# EasyEDA schematic SCH_脑机检测_2021-08-07.json
TITLE: 脑电信号采集主控板; REV: 1.0; Date: 2021-07-29; Sheet: 1/1; Drawn By: SupberMan; Company: Your Company
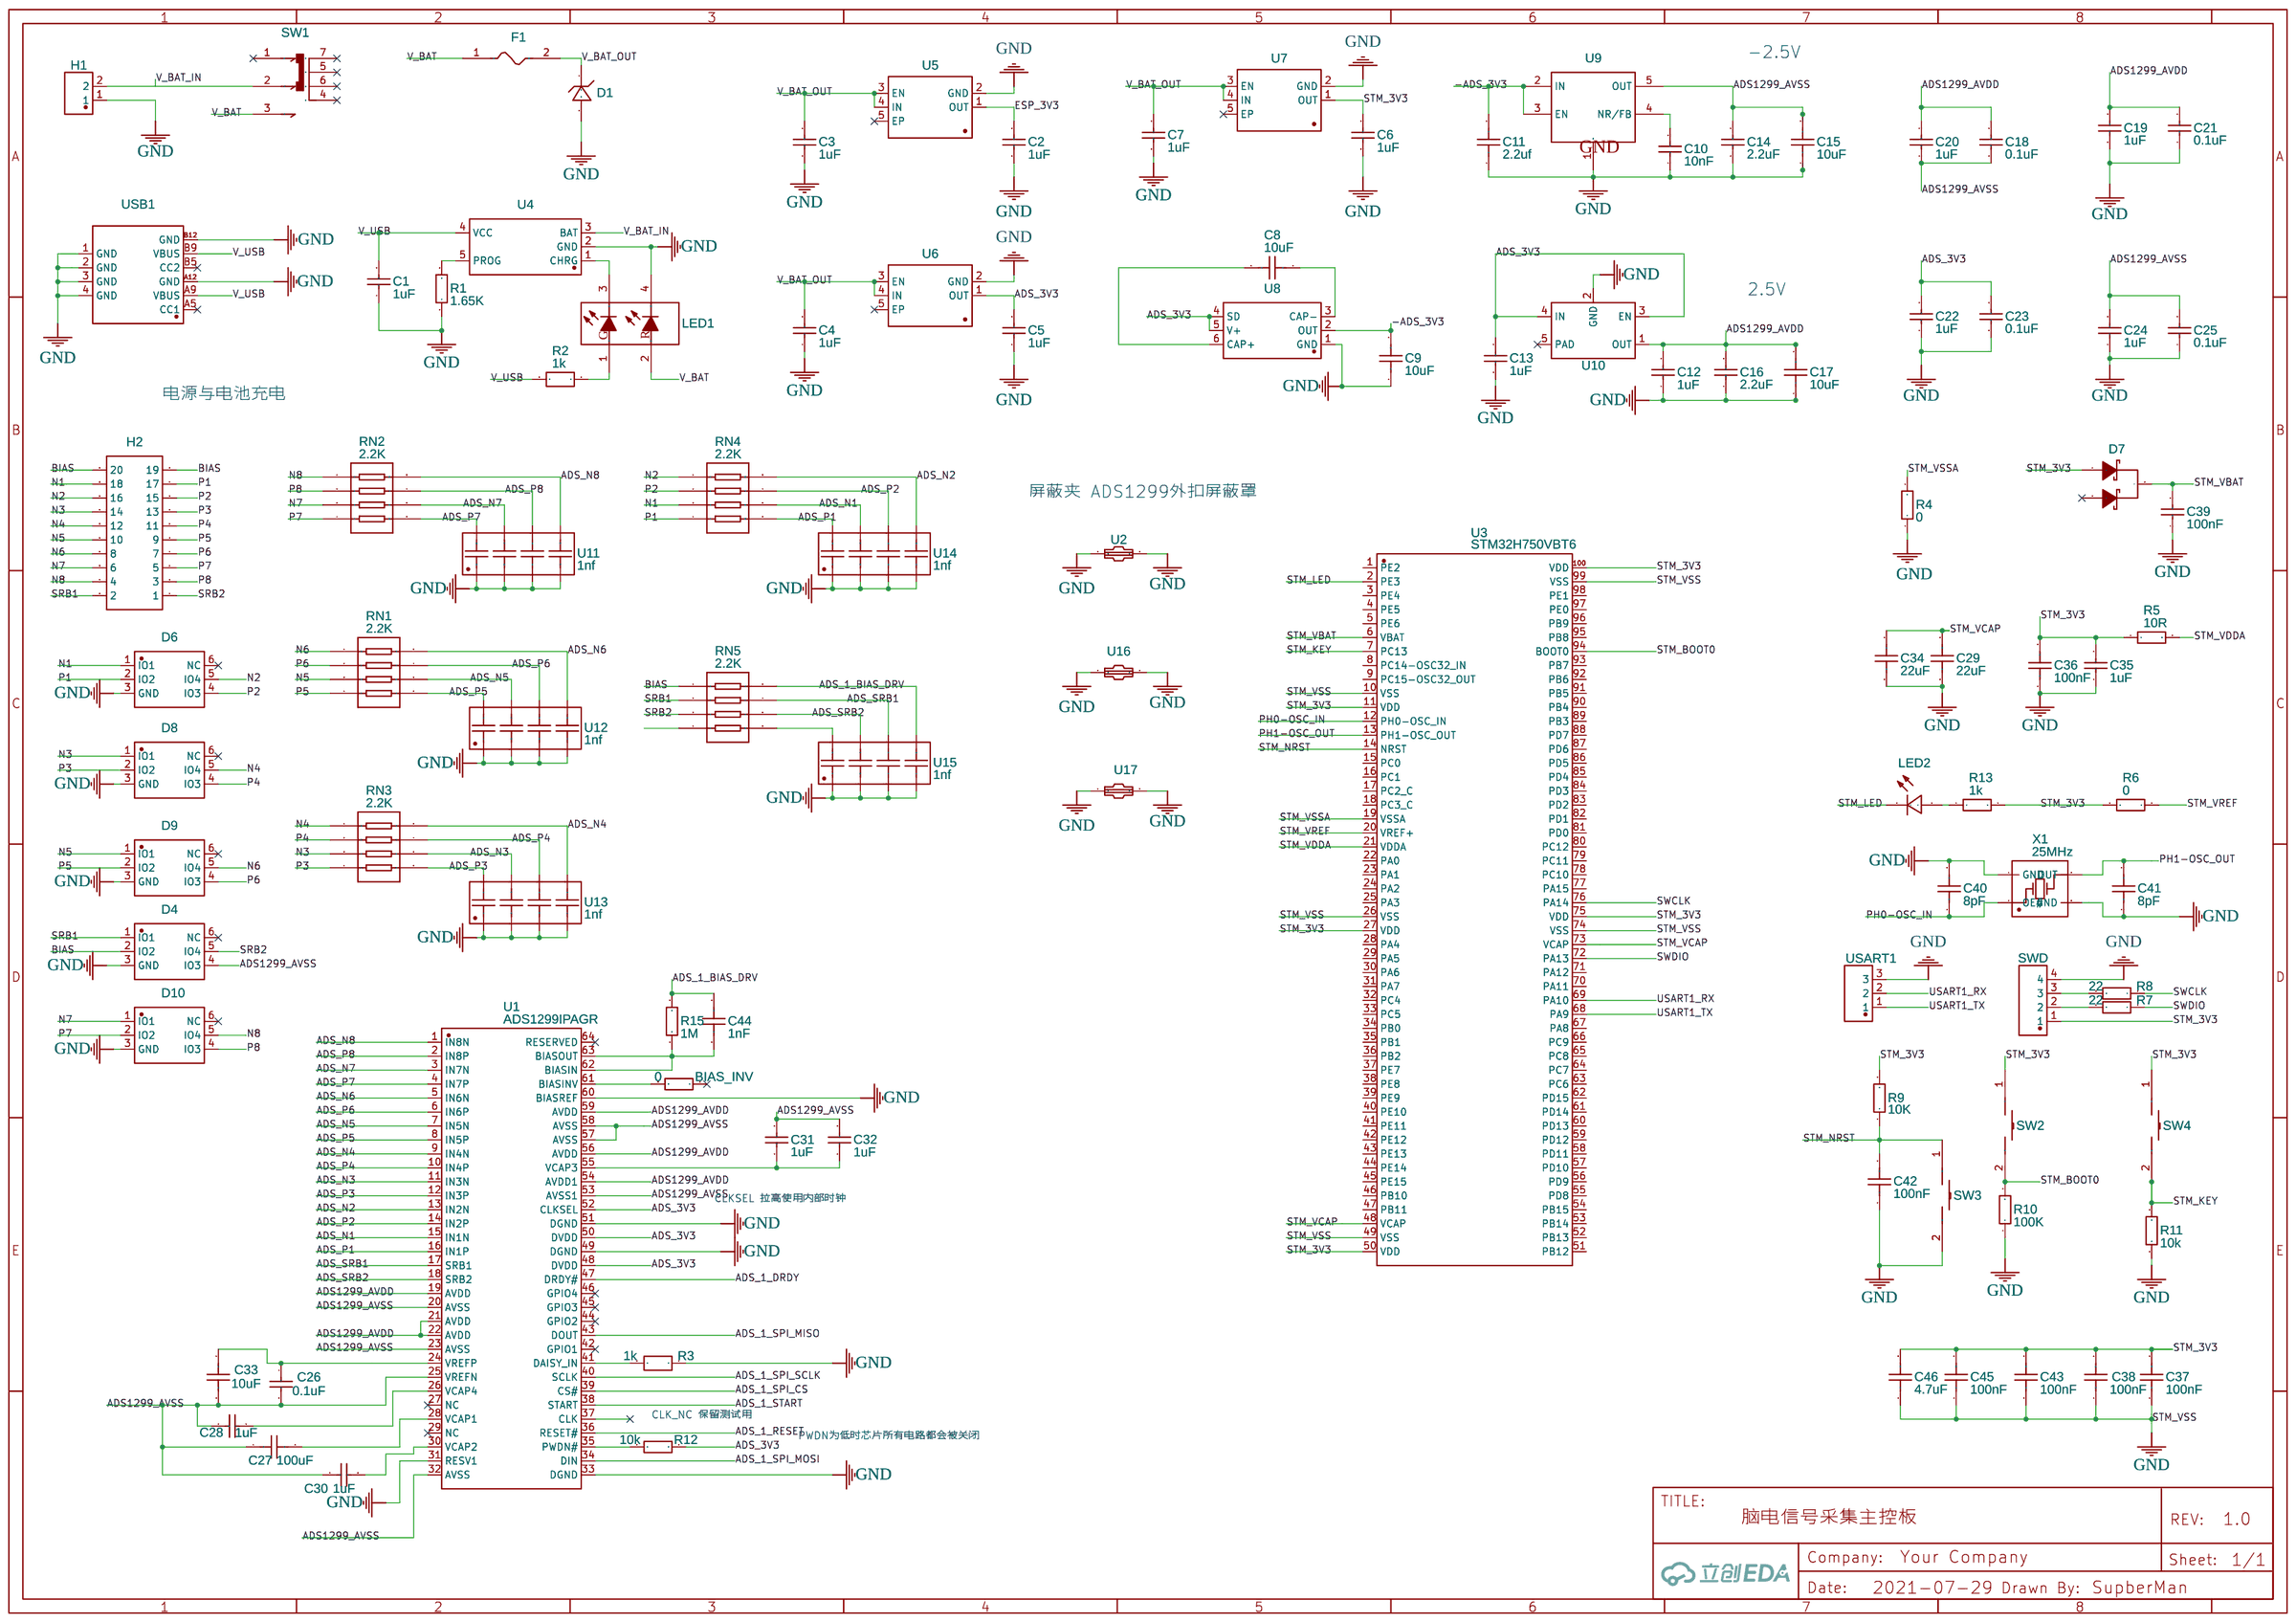
[diagram p0: schematic sheet]

## Parts
BIAS_INV  0  [R0402]
C1  1uF  [C0603]
C2  1uF  [C0402]
C3  1uF  [C0603]
C4  1uF  [C0603]
C5  1uF  [C0402]
C6  1uF  [C0402]
C7  1uF  [C0603]
C8  10uF  [C0603]
C9  10uF  [C0603]
C10  10nF  [C0402]
C11  2.2uf  [C0402]
C12  1uF  [C0402]
C13  1uF  [C0402]
C14  2.2uF  [C0402]
C15  10uF  [C0603]
C16  2.2uF  [C0402]
C17  10uF  [C0603]
C18  0.1uF  [C0402]
C19  1uF  [C0402]
C20  1uF  [C0402]
C21  0.1uF  [C0402]
C22  1uF  [C0402]
C23  0.1uF  [C0402]
C24  1uF  [C0402]
C25  0.1uF  [C0402]
C26  0.1uF  [C0402]
C27  100uF  [C1210]
C28  1uF  [C0402]
C29  22uF  [C0402]
C30  1uF  [C0402]
C31  1uF  [C0402]
C32  1uF  [C0402]
C33  10uF  [C0603]
C34  22uF  [C0402]
C35  1uF  [C0402]
C36  100nF  [C0402]
C37  100nF  [C0402]
C38  100nF  [C0402]
C39  100nF  [C0402_NEW]
C40  8pF  [C0402]
C41  8pF  [C0402]
C42  100nF  [C0402]
C43  100nF  [C0402]
C44  1nF  [C0402]
C45  100nF  [C0402]
C46  4.7uF  [C0402]
D1  PTVS6V5S1UR  [SOD-123_L2.8-W1.8-LS3.7-RD]
D4  TPD4E1B06DCKR  [SC-70-6_L2.2-W1.3-P0.65-LS2.1-BL]
D6  TPD4E1B06DCKR  [SC-70-6_L2.2-W1.3-P0.65-LS2.1-BL]
D7  BAT54C_C556168  [SOT-23-3_L2.9-W1.3-P1.90-LS2.4-BR]
D8  TPD4E1B06DCKR  [SC-70-6_L2.2-W1.3-P0.65-LS2.1-BL]
D9  TPD4E1B06DCKR  [SC-70-6_L2.2-W1.3-P0.65-LS2.1-BL]
D10  TPD4E1B06DCKR  [SC-70-6_L2.2-W1.3-P0.65-LS2.1-BL]
F1  SMD0805-100  [F0805]
H1  GP26-2520WV-2P  [HDR-TH_2P-P2.54-V-M]
H2  A2541WR-2X10P  [CONN-TH_A2541WR-2X10P]
LED1  HSMF-C165  [LED-SMD_HSMF-C165]
LED2  D-G060306G1-KS2  [LED0603-RD]
R1  1.65K  [R0603]
R2  1k  [R0402]
R3  1k  [R0402]
R4  0  [R0402]
R5  10R  [R0402]
R6  0  [R0402]
R7  22  [R0402]
R8  22  [R0402]
R9  10K  [R0402]
R10  100K  [R0402]
R11  10k  [R0402]
R12  10k  [R0402]
R13  1k  [R0402]
R15  1M  [R0402]
RN1  2.2K  [RES-ARRAY-SMD_0603-8P-L3.2-W1.6-BL]
RN2  2.2K  [RES-ARRAY-SMD_0603-8P-L3.2-W1.6-BL]
RN3  2.2K  [RES-ARRAY-SMD_0603-8P-L3.2-W1.6-BL]
RN4  2.2K  [RES-ARRAY-SMD_0603-8P-L3.2-W1.6-BL]
RN5  2.2K  [RES-ARRAY-SMD_0603-8P-L3.2-W1.6-BL]
SW1  TA-3524A-A1-W  [CONN-TH_TA-3524A-A2]
SW2  MPTFP2-V-T/R  [KEY-SMD_L4.0-W2.9-LS4.8]
SW3  MPTFP2-V-T/R  [KEY-SMD_L4.0-W2.9-LS4.8]
SW4  MPTFP2-V-T/R  [KEY-SMD_L4.0-W2.9-LS4.8]
SWD  12251104CNSNS295001  [HDR-TH_4P-P2.54-V-M-1]
U1  ADS1299IPAGR  [TQFP-64_L10.0-W10.0-P0.50-LS12.0-TL]
U2  ICSRC3910SFR  [CONN-SMD_L3.9-W0.8]
U3  STM32H750VBT6  [LQFP-100_L14.0-W14.0-P0.50-LS16.0-BL]
U4  ME4074AM5G  [SOT-23-5_L3.0-W1.7-P0.95-LS2.8-BR]
U5  LP5907SNX-3.3/NOPB  [XDFN-4_L1.0-W1.0-P0.65-BL-EP]
U6  LP5907SNX-3.3/NOPB  [XDFN-4_L1.0-W1.0-P0.65-BL-EP]
U7  LP5907SNX-3.3/NOPB  [XDFN-4_L1.0-W1.0-P0.65-BL-EP]
U8  LM2664M6/NOPB  [SOT-23-6_L2.9-W1.6-P0.95-LS2.8-BL]
U9  TPS72325DBVR  [SOT-23-5_L3.0-W1.7-P0.95-LS2.8-BR]
U10  LP5907SNX-2.5NOPB  [UDFN-4_L1.0-W1.0-P0.65-BL-EP]
U11  1nf  [CAP-ARRAY-SMD_0603-8P-L3.2-W1.6-BL]
U12  1nf  [CAP-ARRAY-SMD_0603-8P-L3.2-W1.6-BL]
U13  1nf  [CAP-ARRAY-SMD_0603-8P-L3.2-W1.6-BL]
U14  1nf  [CAP-ARRAY-SMD_0603-8P-L3.2-W1.6-BL]
U15  1nf  [CAP-ARRAY-SMD_0603-8P-L3.2-W1.6-BL]
U16  ICSRC3910SFR  [CONN-SMD_L3.9-W0.8]
U17  ICSRC3910SFR  [CONN-SMD_L3.9-W0.8]
USART1  22032031  [CONN-TH_22032031]
USB1  TYPEC-250D-BCP6  [USB-C-SMD_TYPEC-250D-BCP6]
X1  25MHz  [OSC-SMD_4P-L2.0-W1.6-BL]

## Library data of the parts
BIAS_INV R4-R6 R10-R13 = 0402WGJ0000TCE: Supplier: LCSC; Manufacturer: UniOhm; Supplier Part: C21376; JLCPCB Part Class: Extended Part
C1 C3 C4 C7 = 0603F105M160NT: Supplier: LCSC; Manufacturer: FH; Supplier Part: C1689; JLCPCB Part Class: Extended Part
C2 C5 C6 C12 C13 C35 = 0402B105K100NT: Supplier: LCSC; Manufacturer: FH; Supplier Part: C1526; JLCPCB Part Class: Extended Part
C8 C9 C15 C17 C33 = GRT188R61E106ME13D: Supplier: LCSC; Supplier Part: C697423; Manufacturer: Murata Electronics; Contributor: LCSC; JLCPCB Part Class: Extended Part
C10 C14 C16 C18-C26 C28 C30-C32 = 0402B103K500NT: Supplier: LCSC; Manufacturer: FH; Supplier Part: C1524; JLCPCB Part Class: Extended Part
C11 = EMK105CC6225KV-F: Supplier: LCSC; Supplier Part: C697612; Manufacturer: TAIYO YUDEN(太诱); Contributor: LCSC; JLCPCB Part Class: Extended Part
C27 = 1210X107M6R3CT: Supplier: LCSC; Supplier Part: C509278; Manufacturer: Walsin Tech Corp; Contributor: LCSC
C29 C34 = GRM155R60J226ME11D: Supplier: LCSC; Supplier Part: C415703; Manufacturer: Murata Electronics; Contributor: LCSC; JLCPCB Part Class: Extended Part
C36-C38 C43 C45 = CC0402KRX7R7BB104: Supplier: LCSC; Manufacturer: YAGEO; Supplier Part: C60474; JLCPCB Part Class: Extended Part
C39 = CL05B104KO5NNNC: Supplier: LCSC; Manufacturer: SAMSUNG; Supplier Part: C1525; JLCPCB Part Class: Basic Part
C40 C41 = AC0402DRNPO9BN8R0: Supplier: LCSC; Supplier Part: C705009; Manufacturer: YAGEO; Contributor: LCSC
C42 = TMK105BJ104KV-F: Supplier: LCSC; Manufacturer: TAIYO YUDEN; Supplier Part: C92826
C44 = 0402YC102KAT2A: Supplier: LCSC; Supplier Part: C597052; Manufacturer: AVX; Contributor: LCSC
C46 = JMK105BC6475MV-F: Supplier: LCSC; Supplier Part: C697614; Manufacturer: Taiyo Yuden; Contributor: LCSC
D1 = PTVS6V5S1UR: Supplier: LCSC; Supplier Part: C85179; Manufacturer: Nexperia; Contributor: LCSC; JLCPCB Part Class: Extended Part
D4 D6 D8-D10 = TPD4E1B06DCKR: Supplier: LCSC; Supplier Part: C840093; Manufacturer: TI(德州仪器); Contributor: LCSC; JLCPCB Part Class: Extended Part
D7 = BAT54C_C556168: Supplier: LCSC; Supplier Part: C556168; Manufacturer: Slkor(SLKORMICRO Elec.); Manufacturer Part: BAT54C; Contributor: LCSC; JLCPCB Part Class: Extended Part
F1 = SMD0805-100: Supplier: LCSC; Manufacturer: TECHFUSE; Supplier Part: C70061; JLCPCB Part Class: Extended Part
H1 = GP26-2520WV-2P: Supplier: LCSC; Supplier Part: C2681737; Manufacturer: GEPU(歌普); Contributor: LCSC; JLCPCB Part Class: Extended Part
H2 = A2541WR-2X10P: Supplier: LCSC; Supplier Part: C239341; Manufacturer: Changjiang Connectors; Manufacturer Part: A2541WR-2x10P; Contributor: LCSC; link: https://item.szlcsc.com/238445.html?ref=editor&logined=true; JLCPCB Part Class: Extended Part
LED1 = HSMF-C165: Supplier: LCSC; Supplier Part: C188726; Manufacturer: Broadcom; Contributor: LCSC; JLCPCB Part Class: Extended Part
LED2 = D-G060306G1-KS2: Supplier: LCSC; Supplier Part: C118334; Manufacturer: Wuxi ARK Tech Elec; Contributor: LCSC; JLCPCB Part Class: Extended Part
R1 = RMC06031.65K1%N: Supplier: LCSC; Supplier Part: C269417; Manufacturer: Tyohm; Contributor: LCSC; JLCPCB Part Class: Extended Part
R2 R3 = CRCW04021K00JNED: Supplier: LCSC; Supplier Part: C191588; Manufacturer: Vishay Intertech; Contributor: LCSC; JLCPCB Part Class: Extended Part
R7 R8 = CR0402FF22R0G: Supplier: LCSC; Manufacturer: LIZ; Supplier Part: C100318; JLCPCB Part Class: Extended Part
R9 = TR0402D10KQ1025: Supplier: LCSC; Supplier Part: C149898; Manufacturer: Ever Ohms Tech; Contributor: LCSC; JLCPCB Part Class: Extended Part
R15 = MR04X105JTL: Supplier: LCSC; Supplier Part: C327805; Manufacturer: Huaxin S&T; Contributor: LCSC
RN1-RN5 = 4D03WGJ0222T5E: Supplier: LCSC; Manufacturer: UniOhm; Supplier Part: C12001; JLCPCB Part Class: Extended Part
SW1 = TA-3524A-A1-W: Supplier: LCSC; Supplier Part: C730329; Manufacturer: Yuandi; Contributor: LCSC; JLCPCB Part Class: Extended Part
SW2-SW4 = MPTFP2-V-T/R: Supplier: LCSC; Supplier Part: C495942; Manufacturer: Diptronics; Contributor: LCSC; JLCPCB Part Class: Extended Part
SWD = 12251104CNSNS295001: Supplier: LCSC; Supplier Part: C355292; Manufacturer: JILN; Contributor: LCSC; JLCPCB Part Class: Extended Part
U1 = ADS1299IPAGR: Supplier: LCSC; Supplier Part: C476817; Manufacturer: TI(德州仪器); Contributor: LCSC; JLCPCB Part Class: Extended Part
U2 U16 U17 = ICSRC3910SFR: Supplier: LCSC; Supplier Part: C238204; Manufacturer: ICT; Contributor: LCSC; JLCPCB Part Class: Extended Part
U3 = STM32H750VBT6: Supplier: LCSC; Supplier Part: C404010; Manufacturer: STMicroelectronics; Contributor: LCSC; JLCPCB Part Class: Extended Part
U4 = ME4074AM5G: Supplier: LCSC; Supplier Part: C236729; Manufacturer: Nanjing Micro One Elec; Contributor: LCSC; JLCPCB Part Class: Extended Part
U5-U7 = LP5907SNX-3.3/NOPB: Supplier: LCSC; Manufacturer: TI; Contributor: LCSC; Supplier Part: C133572; JLCPCB Part Class: Extended Part
U8 = LM2664M6/NOPB: Supplier: LCSC; Supplier Part: C840095; Manufacturer: TI(德州仪器); Contributor: LCSC; JLCPCB Part Class: Extended Part
U9 = TPS72325DBVR: Supplier: LCSC; Manufacturer: TI; Contributor: LCSC; Supplier Part: C69932; JLCPCB Part Class: Extended Part
U10 = LP5907SNX-2.5NOPB: Supplier: LCSC; Manufacturer: TI; Supplier Part: C133571; JLCPCB Part Class: Extended Part
U11-U15 = CKCA43X7R1H102MT010N: Supplier: LCSC; Supplier Part: C338043; Manufacturer: TDK; Contributor: LCSC; 容值: 1nF; JLCPCB Part Class: Extended Part
USART1 = 22032031: Supplier: LCSC; Supplier Part: C505002; Manufacturer: MOLEX; Contributor: LCSC; JLCPCB Part Class: Extended Part
USB1 = TYPEC-250D-BCP6: Supplier: LCSC; Supplier Part: C720626; Manufacturer: XUNPU; Contributor: LCSC; JLCPCB Part Class: Extended Part
X1 = Q22FA1280056900: Supplier: LCSC; Supplier Part: C193187; Manufacturer: Seiko Epson; Contributor: LCSC; JLCPCB Part Class: Extended Part

## Nets
GND: C1.1 C2.1 C3.1 C4.1 C5.1 C6.1 C7.1 C9.1 C10.1 C11.1 C12.1 C13.1 C14.1 C15.1 C16.1 C17.1 C19.1 C21.1 C22.1 C23.1 C24.1 C25.1 C29.2 C34.2 C35.1 C36.1 C37.1 C38.1 C39.1 C40.2 C41.1 C42.1 C43.1 C45.1 C46.1 D1.2 D4.3(GND) D6.3(GND) D8.3(GND) D9.3(GND) D10.3(GND) H1.1 LED1.4(K2) R1.1 R3.1 R4.1 R10.1 R11.1 SW3.2 SWD.4 U1.31(RESV1) U1.33(DGND) U1.49(DGND) U1.51(DGND) U1.60(BIASREF) U2.1 U2.2 U3.10(VSS) U3.26(VSS) U3.49(VSS) U3.74(VSS) U3.99(VSS) U4.2(GND) U5.2(GND) U6.2(GND) U7.2(GND) U8.1(GND) U9.1(GND) U10.2(GND) U11.1 U11.2 U11.3 U11.4 U12.1 U12.2 U12.3 U12.4 U13.1 U13.2 U13.3 U13.4 U14.1 U14.2 U14.3 U14.4 U15.1 U15.2 U15.3 U15.4 U16.1 U16.2 U17.1 U17.2 USART1.3 USB1.1(GND) USB1.2(GND) USB1.3(GND) USB1.4(GND) USB1.A12(GND) USB1.B12(GND) X1.2(GND) X1.4(GND)
-ADS_3V3: C9.2 C11.2 U8.2(OUT) U9.2(IN) U9.3(EN)
ADS1299_AVDD: C12.2 C16.2 C17.2 C18.2 C19.2 C20.2 C21.2 U1.19(AVDD) U1.21(AVDD) U1.22(AVDD) U1.54(AVDD1) U1.56(AVDD) U1.59(AVDD) U10.1(OUT)
ADS1299_AVSS: C14.2 C15.2 C18.1 C20.1 C24.2 C25.2 C26.2 C27.1 C28.1 C30.1 C31.2 C32.2 C33.2 D4.4(IO3) U1.20(AVSS) U1.23(AVSS) U1.25(VREFN) U1.32(AVSS) U1.53(AVSS1) U1.57(AVSS) U1.58(AVSS) U9.5(OUT)
ADS_1_BIAS_DRV: C44.1 R15.2 RN5.8 U15.5
ADS_1_DRDY: U1.47(DRDY#)
ADS_1_RESET: U1.36(RESET#)
ADS_1_SPI_CS: U1.39(CS#)
ADS_1_SPI_MISO: U1.43(DOUT)
ADS_1_SPI_MOSI: U1.34(DIN)
ADS_1_SPI_SCLK: U1.40(SCLK)
ADS_1_START: U1.38(START)
ADS_3V3: C5.2 C13.2 C22.2 C23.2 R12.1 U1.48(DVDD) U1.50(DVDD) U1.52(CLKSEL) U6.1(OUT) U8.4(SD) U8.5(V+) U10.3(EN) U10.4(IN)
ADS_N1: RN4.6 U1.15(IN1N) U14.7
ADS_N2: RN4.8 U1.13(IN2N) U14.5
ADS_N3: RN3.6 U1.11(IN3N) U13.7
ADS_N4: RN3.8 U1.9(IN4N) U13.5
ADS_N5: RN1.6 U1.7(IN5N) U12.7
ADS_N6: RN1.8 U1.5(IN6N) U12.5
ADS_N7: RN2.6 U1.3(IN7N) U11.7
ADS_N8: RN2.8 U1.1(IN8N) U11.5
ADS_P1: RN4.5 U1.16(IN1P) U14.8
ADS_P2: RN4.7 U1.14(IN2P) U14.6
ADS_P3: RN3.5 U1.12(IN3P) U13.8
ADS_P4: RN3.7 U1.10(IN4P) U13.6
ADS_P5: RN1.5 U1.8(IN5P) U12.8
ADS_P6: RN1.7 U1.6(IN6P) U12.6
ADS_P7: RN2.5 U1.4(IN7P) U11.8
ADS_P8: RN2.7 U1.2(IN8P) U11.6
ADS_SRB1: RN5.7 U1.17(SRB1) U15.6
ADS_SRB2: RN5.6 U1.18(SRB2) U15.7
BIAS: D4.2(IO2) H2.19 H2.20 RN5.1
ESP_3V3: C2.2 U5.1(OUT)
N1: D6.1(IO1) H2.18 RN4.3
N2: D6.5(IO4) H2.16 RN4.1
N3: D8.1(IO1) H2.14 RN3.3
N4: D8.5(IO4) H2.12 RN3.1
N5: D9.1(IO1) H2.10 RN1.3
N6: D9.5(IO4) H2.8 RN1.1
N7: D10.1(IO1) H2.6 RN2.3
N8: D10.5(IO4) H2.4 RN2.1
P1: D6.2(IO2) H2.17 RN4.4
P2: D6.4(IO3) H2.15 RN4.2
P3: D8.2(IO2) H2.13 RN3.4
P4: D8.4(IO3) H2.11 RN3.2
P5: D9.2(IO2) H2.9 RN1.4
P6: D9.4(IO3) H2.7 RN1.2
P7: D10.2(IO2) H2.5 RN2.4
P8: D10.4(IO3) H2.3 RN2.2
PH0-OSC_IN: C40.1 U3.12(PH0-OSC_IN) X1.1(OE#)
PH1-OSC_OUT: C41.2 U3.13(PH1-OSC_OUT) X1.3(OUT)
SRB1: D4.1(IO1) H2.2 RN5.2
SRB2: D4.5(IO4) H2.1 RN5.3
STM_3V3: C6.2 C35.2 C36.2 C37.2 C38.2 C43.2 C45.2 C46.2 D7.1(+) R5.1 R6.2 R9.2 R13.2 SW2.1 SW4.1 SWD.1 U3.11(VDD) U3.27(VDD) U3.50(VDD) U3.75(VDD) U3.100(VDD) U7.1(OUT)
STM_BOOT0: R10.2 SW2.2 U3.94(BOOT0)
STM_KEY: R11.2 SW4.2 U3.7(PC13)
STM_LED: LED2.1(-) U3.2(PE3)
STM_NRST: C42.2 R9.1 SW3.1 U3.14(NRST)
STM_VBAT: C39.2 D7.3(-) U3.6(VBAT)
STM_VCAP: C29.1 C34.1 U3.48(VCAP) U3.73(VCAP)
STM_VDDA: R5.2 U3.21(VDDA)
STM_VREF: R6.1 U3.20(VREF+)
STM_VSSA: R4.2 U3.19(VSSA)
SWCLK: R8.1 U3.76(PA14)
SWDIO: R7.1 U3.72(PA13)
USART1_RX: U3.69(PA10) USART1.2
USART1_TX: U3.68(PA9) USART1.1
V_BAT: F1.1 LED1.2(A2) SW1.3
V_BAT_IN: H1.2 SW1.2 U4.3(BAT)
V_BAT_OUT: C3.2 C4.2 C7.2 D1.1 F1.2 U5.3(EN) U5.4(IN) U6.3(EN) U6.4(IN) U7.3(EN) U7.4(IN)
V_USB: C1.2 R2.2 U4.4(VCC) USB1.A9(VBUS) USB1.B9(VBUS)
Net-(BIAS_INV-2): BIAS_INV.2 U1.61(BIASINV)
Net-(C8-1): C8.1 U8.3(CAP-)
Net-(C8-2): C8.2 U8.6(CAP+)
Net-(C10-2): C10.2 U9.4(NR/FB)
Net-(C26-1): C26.1 C33.1 U1.24(VREFP)
Net-(C27-2): C27.2 U1.28(VCAP1)
Net-(C28-2): C28.2 U1.26(VCAP4)
Net-(C30-2): C30.2 U1.30(VCAP2)
Net-(C31-1): C31.1 C32.1 U1.55(VCAP3)
Net-(C44-2): C44.2 R15.1 U1.62(BIASIN) U1.63(BIASOUT)
Net-(LED1-1): LED1.1(A1) R2.1
Net-(LED1-3): LED1.3(K1) U4.1(CHRG)
Net-(LED2-2): LED2.2(+) R13.1
Net-(R1-2): R1.2 U4.5(PROG)
Net-(R3-2): R3.2 U1.41(DAISY_IN)
Net-(R7-2): R7.2 SWD.2
Net-(R8-2): R8.2 SWD.3
Net-(R12-2): R12.2 U1.35(PWDN#)
Net-(RN5-5): RN5.5 U15.8

Not connected (* = marked no-connect by the designer): BIAS_INV 1*; D4 6(NC)*; D6 6(NC)*; D7 2(+)*; D8 6(NC)*; D9 6(NC)*; D10 6(NC)*; RN5 4; SW1 1* 4* 5* 6* 7*; U1 27(NC)* 29(NC)* 37(CLK) 42(GPIO1)* 44(GPIO2)* 45(GPIO3)* 46(GPIO4)* 64(RESERVED)*; U3 1(PE2) 3(PE4) 4(PE5) 5(PE6) 8(PC14-OSC32_IN) 9(PC15-OSC32_OUT) 15(PC0) 16(PC1) 17(PC2_C) 18(PC3_C) 22(PA0) 23(PA1) 24(PA2) 25(PA3) 28(PA4) 29(PA5) 30(PA6) 31(PA7) 32(PC4) 33(PC5) 34(PB0) 35(PB1) 36(PB2) 37(PE7) 38(PE8) 39(PE9) 40(PE10) 41(PE11) 42(PE12) 43(PE13) 44(PE14) 45(PE15) 46(PB10) 47(PB11) 51(PB12) 52(PB13) 53(PB14) 54(PB15) 55(PD8) 56(PD9) 57(PD10) 58(PD11) 59(PD12) 60(PD13) 61(PD14) 62(PD15) 63(PC6) 64(PC7) 65(PC8) 66(PC9) 67(PA8) 70(PA11) 71(PA12) 77(PA15) 78(PC10) 79(PC11) 80(PC12) 81(PD0) 82(PD1) 83(PD2) 84(PD3) 85(PD4) 86(PD5) 87(PD6) 88(PD7) 89(PB3) 90(PB4) 91(PB5) 92(PB6) 93(PB7) 95(PB8) 96(PB9) 97(PE0) 98(PE1); U5 5(EP)*; U6 5(EP)*; U7 5(EP)*; U10 5(PAD)*; USB1 A5(CC1)* B5(CC2)*

## Notes on the sheet
- -2.5V
- 2.5V
- 电源与电池充电
- 屏蔽夹 ADS1299外扣屏蔽罩
- CLKSEL 拉高使用内部时钟
- CLK_NC 保留测试用
- PWDN为低时芯片所有电路都会被关闭
